# Altium project Mini RP2350 Board V0.PrjPcb
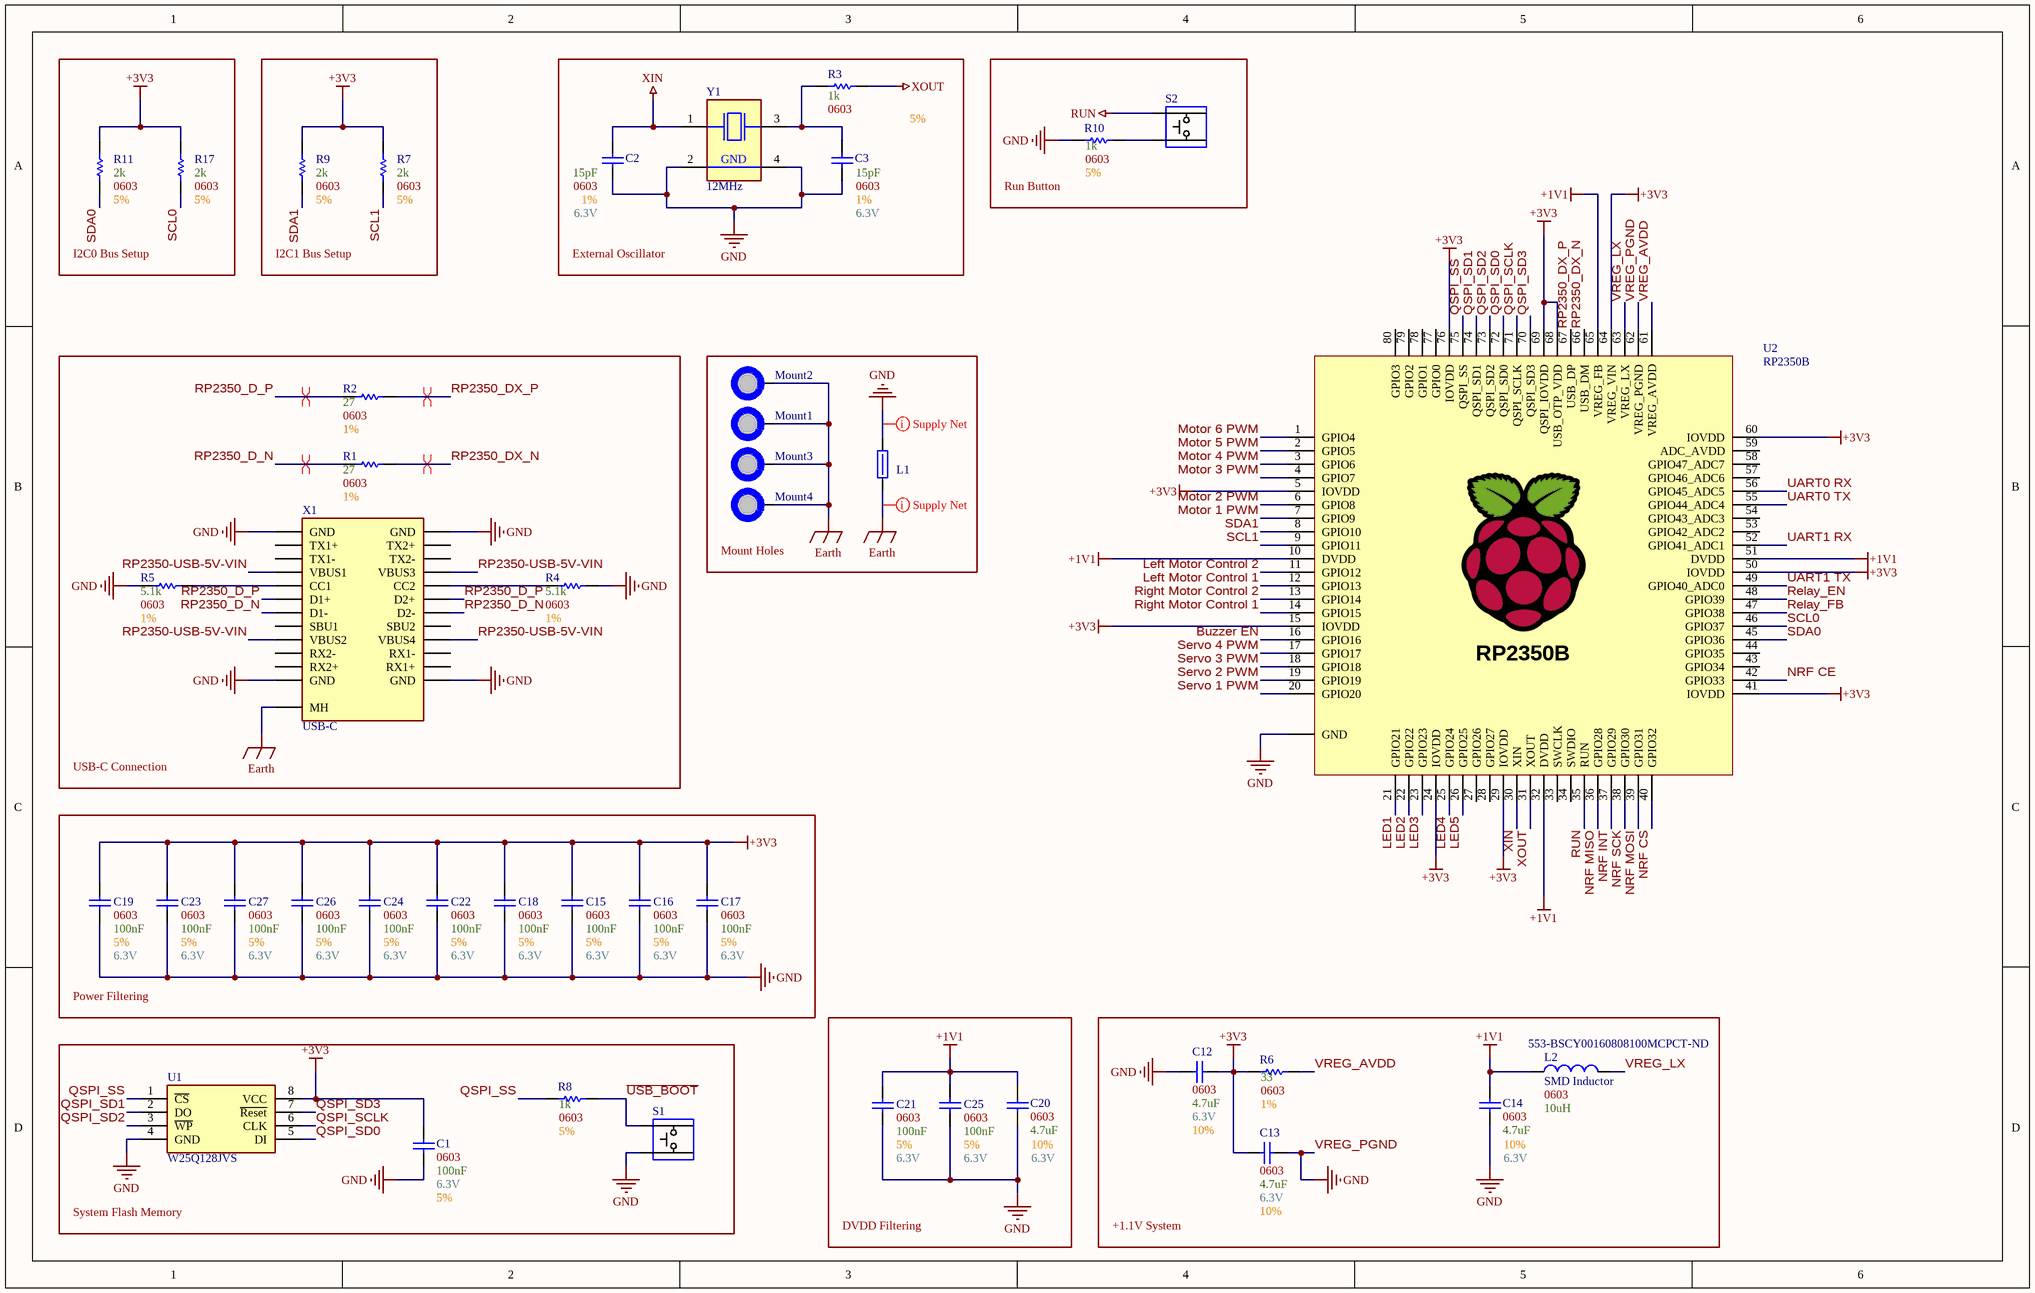
[diagram p0: RP2350.SchDoc]
3 sheets, 79 parts. Net scope: global (net labels, ports and power ports of the same name join across sheets).
Board file: Main.PcbDoc
Sheets:
  RP2350.SchDoc
  Connections.SchDoc
  Safety Devices.SchDoc

## Sheet RP2350.SchDoc
size B; SheetNumber: 1; SheetTotal: 3

### Parts
(Parts that share a designator on the sheet are numbered #1, #2 ... from top to bottom, then left to right.)
C1  Size Package: 0603  Capacitance: 100nF  Voltage: 6.3V  Tolerance: 5%  [[Cap] SMD 0603]  (hidden comment: [Cap] SMD Nonpolarized)
C2  Size Package: 0603  Capacitance: 15pF  Voltage: 6.3V  Tolerance: 1%  [[Cap] SMD 0603]  (hidden comment: [Cap] SMD Nonpolarized)
C3  Size Package: 0603  Capacitance: 15pF  Voltage: 6.3V  Tolerance: 1%  [[Cap] SMD 0603]  (hidden comment: [Cap] SMD Nonpolarized)
C12  Size Package: 0603  Capacitance: 4.7uF  Voltage: 6.3V  Tolerance: 10%  [[Cap] SMD 0603]  (hidden comment: [Cap] SMD Nonpolarized)
C13  Size Package: 0603  Capacitance: 4.7uF  Voltage: 6.3V  Tolerance: 10%  [[Cap] SMD 0603]  (hidden comment: [Cap] SMD Nonpolarized)
C14  Size Package: 0603  Capacitance: 4.7uF  Voltage: 6.3V  Tolerance: 10%  [[Cap] SMD 0603]  (hidden comment: [Cap] SMD Nonpolarized)
C15  Size Package: 0603  Capacitance: 100nF  Voltage: 6.3V  Tolerance: 5%  [[Cap] SMD 0603]  (hidden comment: [Cap] SMD Nonpolarized)
C16  Size Package: 0603  Capacitance: 100nF  Voltage: 6.3V  Tolerance: 5%  [[Cap] SMD 0603]  (hidden comment: [Cap] SMD Nonpolarized)
C17  Size Package: 0603  Capacitance: 100nF  Voltage: 6.3V  Tolerance: 5%  [[Cap] SMD 0603]  (hidden comment: [Cap] SMD Nonpolarized)
C18  Size Package: 0603  Capacitance: 100nF  Voltage: 6.3V  Tolerance: 5%  [[Cap] SMD 0603]  (hidden comment: [Cap] SMD Nonpolarized)
C19  Size Package: 0603  Capacitance: 100nF  Voltage: 6.3V  Tolerance: 5%  [[Cap] SMD 0603]  (hidden comment: [Cap] SMD Nonpolarized)
C20#1  Size Package: 0603  Capacitance: 4.7uF  Voltage: 6.3V  Tolerance: 10%  [[Cap] SMD 0603]  (hidden comment: [Cap] SMD Nonpolarized)
C21#1  Size Package: 0603  Capacitance: 100nF  Voltage: 6.3V  Tolerance: 5%  [[Cap] SMD 0603]  (hidden comment: [Cap] SMD Nonpolarized)
C22#1  Size Package: 0603  Capacitance: 100nF  Voltage: 6.3V  Tolerance: 5%  [[Cap] SMD 0603]  (hidden comment: [Cap] SMD Nonpolarized)
C23#1  Size Package: 0603  Capacitance: 100nF  Voltage: 6.3V  Tolerance: 5%  [[Cap] SMD 0603]  (hidden comment: [Cap] SMD Nonpolarized)
C24#1  Size Package: 0603  Capacitance: 100nF  Voltage: 6.3V  Tolerance: 5%  [[Cap] SMD 0603]  (hidden comment: [Cap] SMD Nonpolarized)
C25#1  Size Package: 0603  Capacitance: 100nF  Voltage: 6.3V  Tolerance: 5%  [[Cap] SMD 0603]  (hidden comment: [Cap] SMD Nonpolarized)
C26#1  Size Package: 0603  Capacitance: 100nF  Voltage: 6.3V  Tolerance: 5%  [[Cap] SMD 0603]  (hidden comment: [Cap] SMD Nonpolarized)
C27#1  Size Package: 0603  Capacitance: 100nF  Voltage: 6.3V  Tolerance: 5%  [[Cap] SMD 0603]  (hidden comment: [Cap] SMD Nonpolarized)
L1  652-MH2029-300Y  [[Ferrite] SMD Bead 0805 (1)]  (value not drawn)
L2#1  SMD Inductor  Size Package: 0603  Inductance: 10uH  Supplier Part Number 1: 553-BSCY00160808100MCPCT-ND  [[Inductor] SMD 0603]
Mount1#1  M3 Mount Hole  [[Mount] M3 Mount Hole]  (value not drawn)  (no BOM)
Mount2#1  M3 Mount Hole  [[Mount] M3 Mount Hole]  (value not drawn)  (no BOM)
Mount3#1  M3 Mount Hole  [[Mount] M3 Mount Hole]  (value not drawn)  (no BOM)
Mount4#1  M3 Mount Hole  [[Mount] M3 Mount Hole]  (value not drawn)  (no BOM)
R1  Tolerance: 1%  Resistance: 27  Size Package: 0603  [[Res] SMD 0603]  (hidden comment: [Res] SMD Resistor)
R2  Tolerance: 1%  Resistance: 27  Size Package: 0603  [[Res] SMD 0603]  (hidden comment: [Res] SMD Resistor)
R3  Resistance: 1k  Size Package: 0603  Tolerance: 5%  [[Res] SMD 0603]  (hidden comment: [Res] SMD Resistor)
R4  Tolerance: 1%  Resistance: 5.1k  Size Package: 0603  [[Res] SMD 0603]  (hidden comment: [Res] SMD Resistor)
R5  Tolerance: 1%  Resistance: 5.1k  Size Package: 0603  [[Res] SMD 0603]  (hidden comment: [Res] SMD Resistor)
R6  Resistance: 33  Size Package: 0603  Tolerance: 1%  [[Res] SMD 0603]  (hidden comment: [Res] SMD Resistor)
R7  Resistance: 2k  Size Package: 0603  Tolerance: 5%  [[Res] SMD 0603]  (hidden comment: [Res] SMD Resistor)
R8  Resistance: 1k  Size Package: 0603  Tolerance: 5%  [[Res] SMD 0603]  (hidden comment: [Res] SMD Resistor)
R9  Resistance: 2k  Size Package: 0603  Tolerance: 5%  [[Res] SMD 0603]  (hidden comment: [Res] SMD Resistor)
R10  Resistance: 1k  Size Package: 0603  Tolerance: 5%  [[Res] SMD 0603]  (hidden comment: [Res] SMD Resistor)
R11  Resistance: 2k  Size Package: 0603  Tolerance: 5%  [[Res] SMD 0603]  (hidden comment: [Res] SMD Resistor)
R17  Resistance: 2k  Size Package: 0603  Tolerance: 5%  [[Res] SMD 0603]  (hidden comment: [Res] SMD Resistor)
S1  Standard pushbutton  [[Switch] Pushbutton]  (value not drawn)
S2  Standard pushbutton  [[Switch] Pushbutton]  (value not drawn)
U1  W25Q128JVS  [[Mem] 16Mb Flash Memory]
U2  RP2350B  [[MCU] RP2350B]
X1  USB-C  [[Port] USB-C]
Y1  12MHz  [[XTAL] SMD 12MHz]

### Blocks framed on the sheet
I2C0 Bus Setup: R11 R17
I2C1 Bus Setup: R7 R9
External Oscillator: C2 C3 R3 Y1
Run Button: R10 S2
USB-C Connection: R1 R2 R4 R5 X1
Mount Holes: L1 Mount1#1 Mount2#1 Mount3#1 Mount4#1
Power Filtering: C15-C19 C22#1 C23#1 C24#1 C26#1 C27#1
DVDD Filtering: C20#1 C21#1 C25#1
+1.1V System: C12-C14 L2#1 R6
System Flash Memory: C1 R8 S1 U1

### Nets
+1V1: C14.2 C20#1.2 C21#1.2 C25#1.2 L2#1.1 U2.10(DVDD) U2.32(DVDD) U2.51(DVDD) U2.65(VREG_FB)
+3V3: C1.1 C12.1 C13.2 C15.2 C16.2 C17.2 C18.2 C19.2 C22#1.2 C23#1.2 C24#1.2 C26#1.2 C27#1.2 R6.2 R7.2 R9.2 R11.2 R17.2 U1.8(VCC) U2.5(IOVDD) U2.15(IOVDD) U2.24(IOVDD) U2.29(IOVDD) U2.41(IOVDD) U2.50(IOVDD) U2.60(IOVDD) U2.64(VREG_VIN) U2.68(USB_OTP_VDD) U2.69(QSPI_IOVDD) U2.76(IOVDD)
Earth: L1.1 Mount1#1.1 Mount2#1.1 Mount3#1.1 Mount4#1.1 X1.MH
GND: C1.2 C2.1 C3.1 C12.2 C13.1 C14.1 C15.1 C16.1 C17.1 C18.1 C19.1 C20#1.1 C21#1.1 C22#1.1 C23#1.1 C24#1.1 C25#1.1 C26#1.1 C27#1.1 L1.2 R4.2 R5.1 R10.2 S1.2 U1.4(GND) U2.62(VREG_PGND) U2.Pad(GND) X1.A1(GND) X1.A12(GND) X1.B1(GND) X1.B12(GND) Y1.2(GND) Y1.4(GND)  [also labelled VREG_PGND]
RUN: S2.1 U2.35(RUN)
XIN: C2.2 U2.30(XIN) Y1.1(XTAL1)
XOUT: R3.1 U2.31(XOUT)
Buzzer EN: U2.16(GPIO16)
LED1: U2.21(GPIO21)
LED2: U2.22(GPIO22)
LED3: U2.23(GPIO23)
LED4: U2.25(GPIO24)
LED5: U2.26(GPIO25)
Left Motor Control 1: U2.12(GPIO13)
Left Motor Control 2: U2.11(GPIO12)
Motor 1 PWM: U2.7(GPIO9)
Motor 2 PWM: U2.6(GPIO8)
Motor 3 PWM: U2.4(GPIO7)
Motor 4 PWM: U2.3(GPIO6)
Motor 5 PWM: U2.2(GPIO5)
Motor 6 PWM: U2.1(GPIO4)
NRF CE: U2.42(GPIO33)
NRF CS: U2.40(GPIO32)
NRF INT: U2.37(GPIO29)
NRF MISO: U2.36(GPIO28)
NRF MOSI: U2.39(GPIO31)
NRF SCK: U2.38(GPIO30)
QSPI_SCLK: U1.6(CLK) U2.71(QSPI_SCLK)
QSPI_SD0: U1.5(DI) U2.72(QSPI_SD0)
QSPI_SD1: U1.2(DO) U2.74(QSPI_SD1)
QSPI_SD2: U1.3(~{WP}) U2.73(QSPI_SD2)
QSPI_SD3: U1.7(~{Reset}) U2.70(QSPI_SD3)
QSPI_SS: R8.2 U1.1(~{CS}) U2.75(QSPI_SS)
Relay_EN: U2.48(GPIO39)
Relay_FB: U2.47(GPIO38)
Right Motor Control 1: U2.14(GPIO15)
Right Motor Control 2: U2.13(GPIO14)
RP2350-USB-5V-VIN: X1.A4(VBUS1) X1.A9(VBUS2) X1.B4(VBUS3) X1.B9(VBUS4)
RP2350_D_N: R1.1 X1.A7(D1-) X1.B7(D2-)
RP2350_D_P: R2.1 X1.A6(D1+) X1.B6(D2+)
RP2350_DX_N: R1.2 U2.66(USB_DM)
RP2350_DX_P: R2.2 U2.67(USB_DP)
SCL0: R17.1 U2.46(GPIO37)
SCL1: R7.1 U2.9(GPIO11)
SDA0: R11.1 U2.45(GPIO36)
SDA1: R9.1 U2.8(GPIO10)
Servo 1 PWM: U2.20(GPIO20)
Servo 2 PWM: U2.19(GPIO19)
Servo 3 PWM: U2.18(GPIO18)
Servo 4 PWM: U2.17(GPIO17)
~{USB_BOOT}: R8.1 S1.1
UART0 RX: U2.56(GPIO45_ADC5)
UART0 TX: U2.55(GPIO44_ADC4)
UART1 RX: U2.52(GPIO41_ADC1)
UART1 TX: U2.49(GPIO40_ADC0)
VREG_AVDD: R6.1 U2.61(VREG_AVDD)
VREG_LX: L2#1.2 U2.63(VREG_LX)
NetC3_2: C3.2 R3.2 Y1.3(XTAL2)
NetR4_1: R4.1 X1.B5(CC2)
NetR5_2: R5.2 X1.A5(CC1)
NetR10_1: R10.1 S2.2

Not connected (* = marked no-connect by the designer): U2 27(GPIO26) 28(GPIO27) 33(SWCLK) 34(SWDIO) 43(GPIO34) 44(GPIO35) 53(GPIO42_ADC2) 54(GPIO43_ADC3) 57(GPIO46_ADC6) 58(GPIO47_ADC7) 59(ADC_AVDD) 77(GPIO0) 78(GPIO1) 79(GPIO2) 80(GPIO3); X1 A2(TX1+) A3(TX1-) A8(SBU1) A10(RX2-) A11(RX2+) B2(TX2+) B3(TX2-) B8(SBU2) B10(RX1-) B11(RX1+)

### Layout directives
differential pair; differential pair class USB_Pairs: RP2350_D_N, RP2350_D_P, RP2350_DX_N, RP2350_DX_P
net class Supply_Nets: Earth, GND

### Library data of the parts
L1 = [Ferrite] SMD Ferrite Bead (1): Res @ Freq: 30 @ 100MHz; Size Package: 0805; Supplier 1: DigiKey; Supplier Part Number 1: MH2029-300YCT-ND
L2#1 = [Inductor] SMD Inductor: JLC Part #: *; Mouser Part #: *; Supplier 1: DigiKey
Mount1#1 Mount2#1 Mount3#1 Mount4#1 = [Mount] M3 Mount Hole: Place at least 4.5mm from board edge. Plated.
R1-R11 R17 = [Res] SMD Resistor: Generic; Supplier 1: DigiKey
  R1 R2: Supplier Part Number 1: 749-1631-1-ND
  R3 R8 R10: Supplier Part Number 1: RMCF0603FT1K00DKR-ND
  R4 R5: Supplier Part Number 1: 311-5.10KHRDKR-ND
  R6: Supplier Part Number 1: RR08Q33DCT-ND
  R7 R9 R11 R17: Supplier Part Number 1: P2.0KBDCT-ND
S1 S2 = [Switch] Pushbutton: Supplier 1: DigiKey; Supplier Part Number 1: 450-1650-ND
U1 = [Mem] 16Mb Flash Memory: W25Q128JVSIQ TR; Supplier 1: DigiKey; Supplier Part Number 1: 256-W25Q128JVSIQTRCT-ND
U2 = [MCU] RP2350B: QFN-80 Package; Supplier 1: DigiKey; Supplier Part Number 1: 2648-SC1510-A4CT-ND
X1 = [Port] USB Type-C: Supplier 1: DigiKey; Supplier Part Number 1: 670-3104-1-ND
Y1 = [XTAL] SMD 12MHz: 815-ABM8-272-T3; Supplier 1: DigiKey; Supplier Part Number 1: 535-ABM8-272-T3CT-ND
C1-C3 C12-C19 C20#1 C21#1 C22#1 C23#1 C24#1 C25#1 C26#1 C27#1 = [Cap] SMD Nonpolarized: Supplier 1: DigiKey
  C1 C15-C19 C21#1 C22#1 C23#1 C24#1 C25#1 C26#1 C27#1: Supplier Part Number 1: 311-1088-6-ND
  C2 C3: Supplier Part Number 1: 490-16416-1-ND
  C12-C14 C20#1: Supplier Part Number 1: 490-7203-1-ND

## Sheet Connections.SchDoc
size B; SheetNumber: 2; SheetTotal: 3
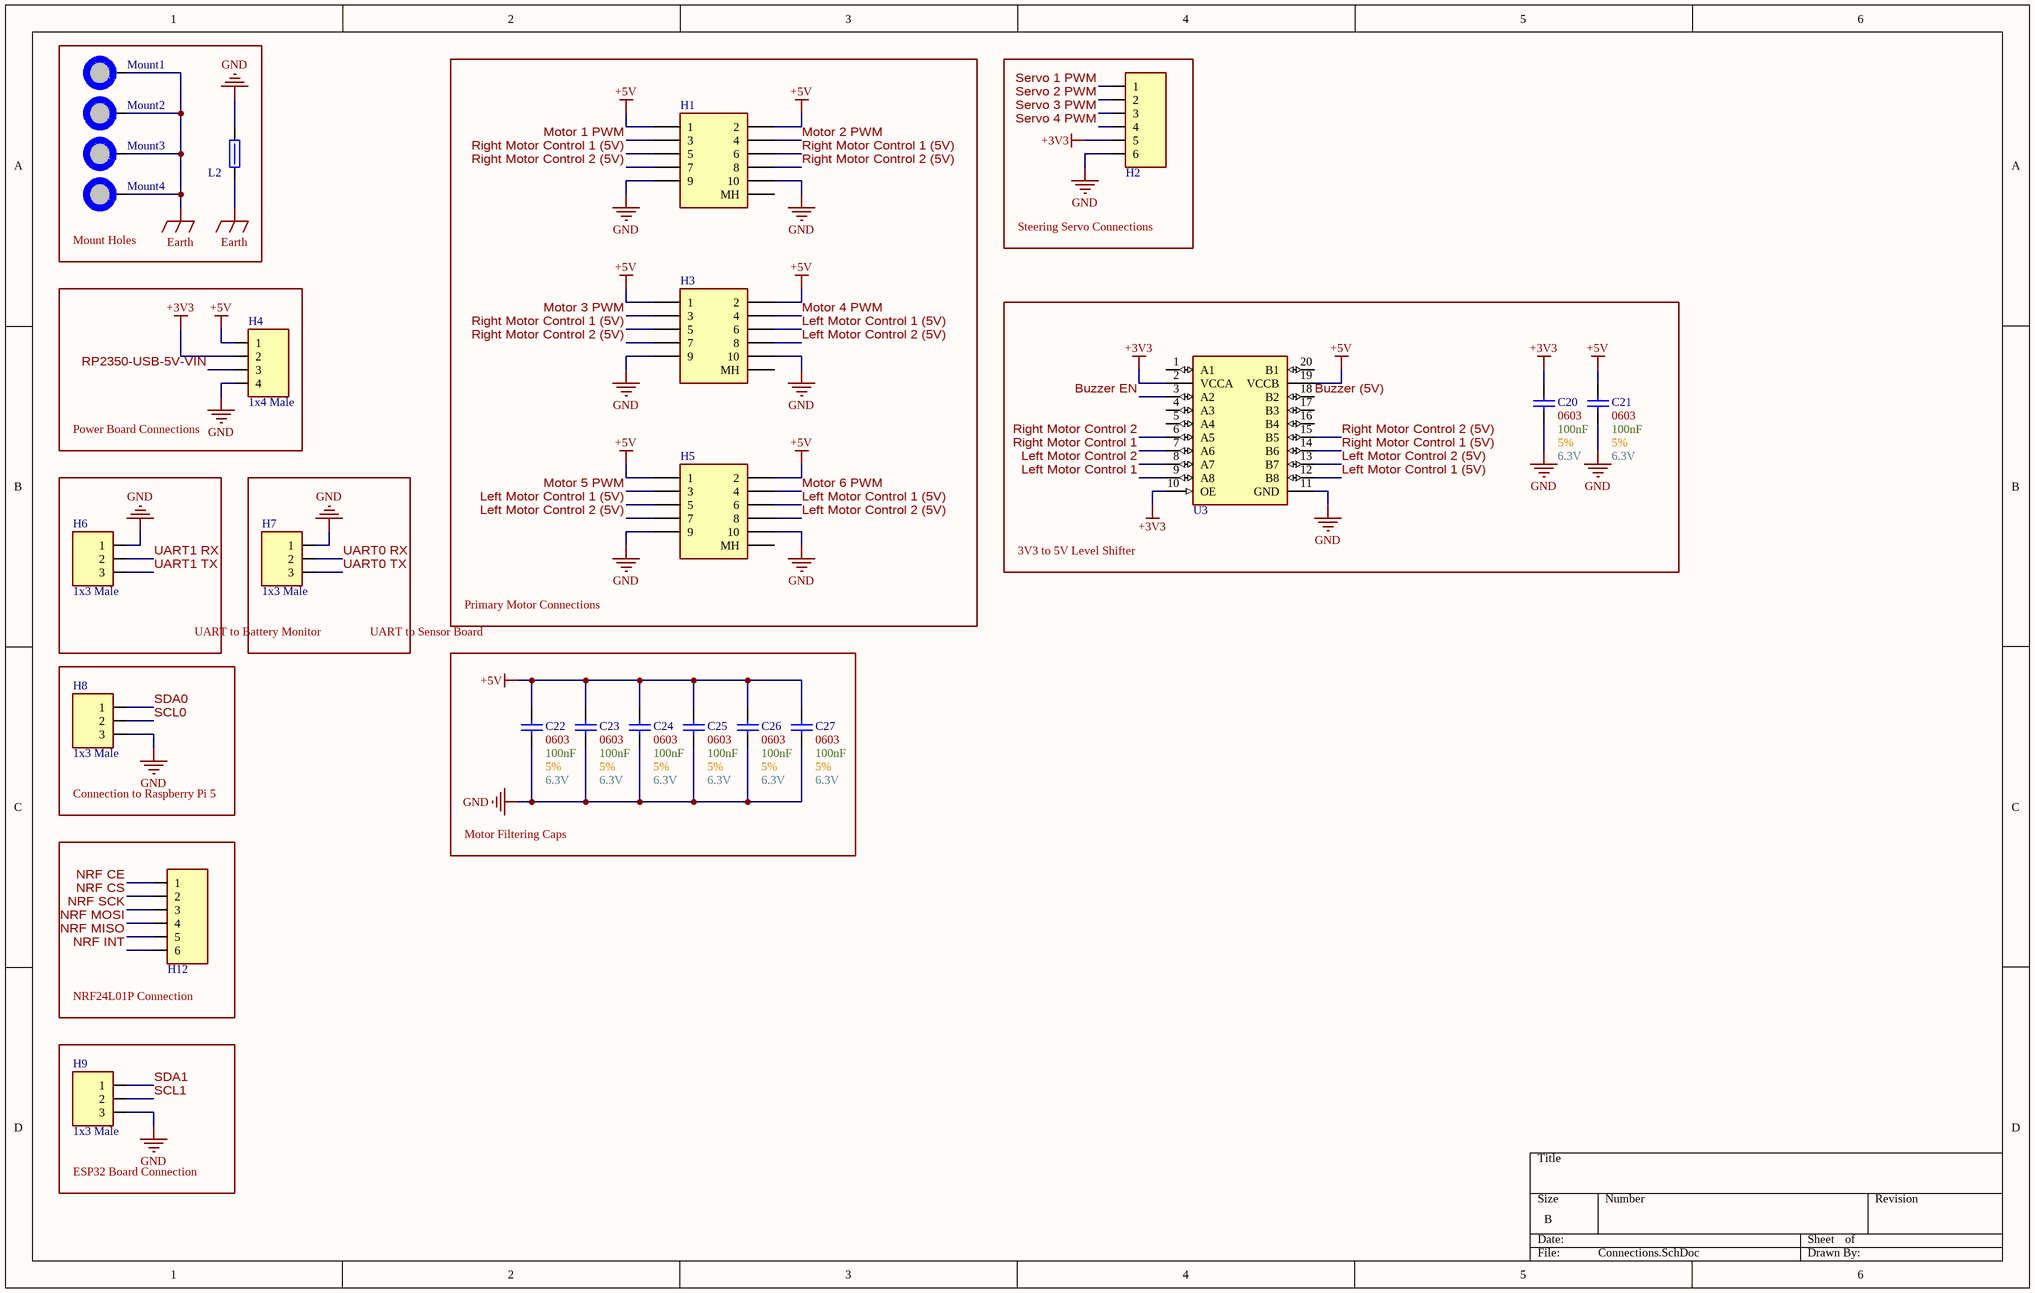
[diagram p1: Connections.SchDoc]

### Parts
(Parts that share a designator on the sheet are numbered #1, #2 ... from top to bottom, then left to right.)
C20#2  Size Package: 0603  Capacitance: 100nF  Voltage: 6.3V  Tolerance: 5%  [[Cap] SMD 0603]  (hidden comment: [Cap] SMD Nonpolarized)
C21#2  Size Package: 0603  Capacitance: 100nF  Voltage: 6.3V  Tolerance: 5%  [[Cap] SMD 0603]  (hidden comment: [Cap] SMD Nonpolarized)
C22#2  Size Package: 0603  Capacitance: 100nF  Voltage: 6.3V  Tolerance: 5%  [[Cap] SMD 0603]  (hidden comment: [Cap] SMD Nonpolarized)
C23#2  Size Package: 0603  Capacitance: 100nF  Voltage: 6.3V  Tolerance: 5%  [[Cap] SMD 0603]  (hidden comment: [Cap] SMD Nonpolarized)
C24#2  Size Package: 0603  Capacitance: 100nF  Voltage: 6.3V  Tolerance: 5%  [[Cap] SMD 0603]  (hidden comment: [Cap] SMD Nonpolarized)
C25#2  Size Package: 0603  Capacitance: 100nF  Voltage: 6.3V  Tolerance: 5%  [[Cap] SMD 0603]  (hidden comment: [Cap] SMD Nonpolarized)
C26#2  Size Package: 0603  Capacitance: 100nF  Voltage: 6.3V  Tolerance: 5%  [[Cap] SMD 0603]  (hidden comment: [Cap] SMD Nonpolarized)
C27#2  Size Package: 0603  Capacitance: 100nF  Voltage: 6.3V  Tolerance: 5%  [[Cap] SMD 0603]  (hidden comment: [Cap] SMD Nonpolarized)
H1  [Header] Shrouded 2x5 SMD  [[Header] Shrouded 2x5 SMD]  (value not drawn)
H2  [Header] Shrouded 1x6 Male  [[Header] Shrouded 1x6 Male]  (value not drawn)
H3  [Header] Shrouded 2x5 SMD  [[Header] Shrouded 2x5 SMD]  (value not drawn)
H4  1x4 Male  [[Header] Shrouded 1x4 Male]
H5#1  [Header] Shrouded 2x5 SMD  [[Header] Shrouded 2x5 SMD]  (value not drawn)
H6  1x3 Male  [[Header] Shrouded 1x3 Male]
H7  1x3 Male  [[Header] Shrouded 1x3 Male]
H8#1  1x3 Male  [[Header] Shrouded 1x3 Male]
H9  1x3 Male  [[Header] Shrouded 1x3 Male]
H12  [Header] Shrouded 1x6 Male  [[Header] Shrouded 1x6 Male]  (value not drawn)
L2#2  652-MH2029-300Y  [[Ferrite] SMD Bead 0805 (1)]  (value not drawn)
Mount1#2  M3 Mount Hole  [[Mount] M3 Mount Hole]  (value not drawn)  (no BOM)
Mount2#2  M3 Mount Hole  [[Mount] M3 Mount Hole]  (value not drawn)  (no BOM)
Mount3#2  M3 Mount Hole  [[Mount] M3 Mount Hole]  (value not drawn)  (no BOM)
Mount4#2  M3 Mount Hole  [[Mount] M3 Mount Hole]  (value not drawn)  (no BOM)
U3  [IC] Level Shifter (2)  [[IC] Level Shifter (2)]  (value not drawn)

### Blocks framed on the sheet
Mount Holes: L2#2 Mount1#2 Mount2#2 Mount3#2 Mount4#2
Primary Motor Connections: H1 H3 H5#1
Steering Servo Connections: H2
Power Board Connections: H4
3V3 to 5V Level Shifter: C20#2 C21#2 U3
UART to Battery Monitor: H6
UART to Sensor Board: H7
Connection to Raspberry Pi 5: H8#1
Motor Filtering Caps: C22#2 C23#2 C24#2 C25#2 C26#2 C27#2
NRF24L01P Connection: H12
ESP32 Board Connection: H9

### Nets
+3V3: C20#2.2 H2.5 H4.2 U3.2(VCCA) U3.10(OE)
+5V: C21#2.2 C22#2.2 C23#2.2 C24#2.2 C25#2.2 C26#2.2 C27#2.2 H1.1 H1.2 H3.1 H3.2 H4.1 H5#1.1 H5#1.2 U3.19(VCCB)
Earth: L2#2.1 Mount1#2.1 Mount2#2.1 Mount3#2.1 Mount4#2.1
GND: C20#2.1 C21#2.1 C22#2.1 C23#2.1 C24#2.1 C25#2.1 C26#2.1 C27#2.1 H1.9 H1.10 H2.6 H3.9 H3.10 H4.4 H5#1.9 H5#1.10 H6.1 H7.1 H8#1.3 H9.3 L2#2.2 U3.11(GND)
Buzzer (5V): U3.18(B2)
Buzzer EN: U3.3(A2)
Left Motor Control 1: U3.9(A8)
Left Motor Control 1 (5V): H3.6 H5#1.5 H5#1.6 U3.12(B8)
Left Motor Control 2: U3.8(A7)
Left Motor Control 2 (5V): H3.8 H5#1.7 H5#1.8 U3.13(B7)
Motor 1 PWM: H1.3
Motor 2 PWM: H1.4
Motor 3 PWM: H3.3
Motor 4 PWM: H3.4
Motor 5 PWM: H5#1.3
Motor 6 PWM: H5#1.4
NRF CE: H12.1
NRF CS: H12.2
NRF INT: H12.6
NRF MISO: H12.5
NRF MOSI: H12.4
NRF SCK: H12.3
Right Motor Control 1: U3.7(A6)
Right Motor Control 1 (5V): H1.5 H1.6 H3.5 U3.14(B6)
Right Motor Control 2: U3.6(A5)
Right Motor Control 2 (5V): H1.7 H1.8 H3.7 U3.15(B5)
RP2350-USB-5V-VIN: H4.3
SCL0: H8#1.2
SCL1: H9.2
SDA0: H8#1.1
SDA1: H9.1
Servo 1 PWM: H2.1
Servo 2 PWM: H2.2
Servo 3 PWM: H2.3
Servo 4 PWM: H2.4
UART0 RX: H7.2
UART0 TX: H7.3
UART1 RX: H6.2
UART1 TX: H6.3

Not connected (* = marked no-connect by the designer): H1 X(MH); H3 X(MH); H5#1 X(MH); U3 1(A1) 4(A3) 5(A4) 16(B4) 17(B3) 20(B1)

### Library data of the parts
H2 H12 = [Header] Shrouded 1x6 Male: 0705430005 / Mates with 0050579406; Supplier 1: DigiKey; Supplier 2: DigiKey; Supplier Part Number 1: WM4804-ND; Supplier Part Number 2: WM2904-ND
H4 = [Header] Shrouded 1x4 Male: 70543-0003 / Mates with 005057-9404; Supplier 1: Avnet; Supplier Part Number 1: 0705430003
H6 H7 H8#1 H9 = [Header] Shrouded 1x3 Male: 070543-0037 / Mates with 005057-9403; Supplier 1: DigiKey; Supplier Part Number 1: WM4825-ND
  H7 H8#1 H9: Supplier 2: DigiKey; Supplier Part Number 2: WM2901-ND
L2#2 = [Ferrite] SMD Ferrite Bead (1): Res @ Freq: 30 @ 100MHz; Size Package: 0805
Mount1#2 Mount2#2 Mount3#2 Mount4#2 = [Mount] M3 Mount Hole: as Mount1#1 on sheet RP2350
U3 = [IC] Level Shifter (2): TXS0108EQPWRQ1; Supplier 1: DigiKey; Supplier Part Number 1: 296-42401-1-ND
C20#2 C21#2 C22#2 C23#2 C24#2 C25#2 C26#2 C27#2 = [Cap] SMD Nonpolarized: Supplier 1: DigiKey; Supplier Part Number 1: 311-1088-6-ND
H1 H3 H5#1 = [Header] Shrouded 2x5 SMD: Supplier 1: DigiKey; Supplier Part Number 1: WM4227-ND

## Sheet Safety Devices.SchDoc
size A; SheetNumber: 3; SheetTotal: 3
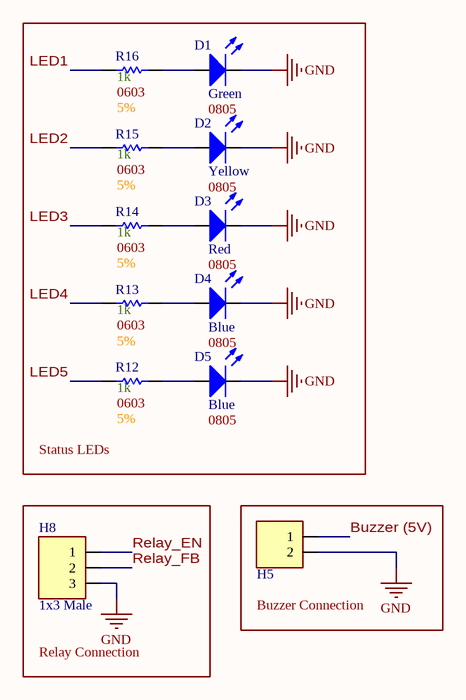
[diagram p2: Safety Devices.SchDoc]

### Parts
(Parts that share a designator on the sheet are numbered #1, #2 ... from top to bottom, then left to right.)
D1  Color: Green  Size Package: 0805  [[LED] SMD 0805]  (hidden comment: SMD LED)
D2  Color: Yellow  Size Package: 0805  [[LED] SMD 0805]  (hidden comment: SMD LED)
D3  Color: Red  Size Package: 0805  [[LED] SMD 0805]  (hidden comment: SMD LED)
D4  Color: Blue  Size Package: 0805  [[LED] SMD 0805]  (hidden comment: SMD LED)
D5  Color: Blue  Size Package: 0805  [[LED] SMD 0805]  (hidden comment: SMD LED)
H5#2  1x2 Male  [[Header] Shrouded 1x2 Male]  (value not drawn)
H8#2  1x3 Male  [[Header] Shrouded 1x3 Male]
R12  Resistance: 1k  Size Package: 0603  Tolerance: 5%  [[Res] SMD 0603]  (hidden comment: [Res] SMD Resistor)
R13  Resistance: 1k  Size Package: 0603  Tolerance: 5%  [[Res] SMD 0603]  (hidden comment: [Res] SMD Resistor)
R14  Resistance: 1k  Size Package: 0603  Tolerance: 5%  [[Res] SMD 0603]  (hidden comment: [Res] SMD Resistor)
R15  Resistance: 1k  Size Package: 0603  Tolerance: 5%  [[Res] SMD 0603]  (hidden comment: [Res] SMD Resistor)
R16  Resistance: 1k  Size Package: 0603  Tolerance: 5%  [[Res] SMD 0603]  (hidden comment: [Res] SMD Resistor)

### Blocks framed on the sheet
Status LEDs: D1-D5 R12-R16
Relay Connection: H8#2
Buzzer Connection: H5#2

### Nets
GND: D1.2(Cathode) D2.2(Cathode) D3.2(Cathode) D4.2(Cathode) D5.2(Cathode) H5#2.2 H8#2.3
Buzzer (5V): H5#2.1
LED1: R16.2
LED2: R15.2
LED3: R14.2
LED4: R13.2
LED5: R12.2
Relay_EN: H8#2.1
Relay_FB: H8#2.2
NetD1_1: D1.1(Anode) R16.1
NetD2_1: D2.1(Anode) R15.1
NetD3_1: D3.1(Anode) R14.1
NetD4_1: D4.1(Anode) R13.1
NetD5_1: D5.1(Anode) R12.1

### Library data of the parts
D1-D5 = [LED] SMD: Generic; Part #: *; Supplier 1: DigiKey
  D1: Supplier Part Number 1: 475-LGR971-KN-1CT-ND
  D2: Supplier Part Number 1: 475-LYR976-PS-36-0-20-R18CT-ND
  D3: Supplier Part Number 1: 475-LSR976-NR-1CT-ND
  D4 D5: Supplier Part Number 1: 732-4982-1-ND
H5#2 = [Header] Shrouded 1x2 Male: 0705430036 / Mates with 0050579402; Supplier 1: DigiKey; Supplier 2: DigiKey; Supplier Part Number 2: WM2900-ND; Supplier Part Number 1: WM4824-ND
H8#2 = [Header] Shrouded 1x3 Male: 070543-0037 / Mates with 005057-9403; Supplier 1: DigiKey; Supplier 2: DigiKey; Supplier Part Number 1: WM4825-ND; Supplier Part Number 2: WM2901-ND
R12-R16 = [Res] SMD Resistor: Generic; Supplier 1: DigiKey; Supplier Part Number 1: RMCF0603FT1K00DKR-ND

## Nets that join several sheets
+3V3: RP2350 (30 pins), Connections (5 pins)
Earth: RP2350 (6 pins), Connections (5 pins)
GND: RP2350 (33 pins), Connections (22 pins), Safety Devices (7 pins)
Buzzer (5V): Connections (U3.18), Safety Devices (H5#2.1)
Buzzer EN: RP2350 (U2.16), Connections (U3.3)
LED1: RP2350 (U2.21), Safety Devices (R16.2)
LED2: RP2350 (U2.22), Safety Devices (R15.2)
LED3: RP2350 (U2.23), Safety Devices (R14.2)
LED4: RP2350 (U2.25), Safety Devices (R13.2)
LED5: RP2350 (U2.26), Safety Devices (R12.2)
Left Motor Control 1: RP2350 (U2.12), Connections (U3.9)
Left Motor Control 2: RP2350 (U2.11), Connections (U3.8)
Motor 1 PWM: RP2350 (U2.7), Connections (H1.3)
Motor 2 PWM: RP2350 (U2.6), Connections (H1.4)
Motor 3 PWM: RP2350 (U2.4), Connections (H3.3)
Motor 4 PWM: RP2350 (U2.3), Connections (H3.4)
Motor 5 PWM: RP2350 (U2.2), Connections (H5#1.3)
Motor 6 PWM: RP2350 (U2.1), Connections (H5#1.4)
NRF CE: RP2350 (U2.42), Connections (H12.1)
NRF CS: RP2350 (U2.40), Connections (H12.2)
NRF INT: RP2350 (U2.37), Connections (H12.6)
NRF MISO: RP2350 (U2.36), Connections (H12.5)
NRF MOSI: RP2350 (U2.39), Connections (H12.4)
NRF SCK: RP2350 (U2.38), Connections (H12.3)
Relay_EN: RP2350 (U2.48), Safety Devices (H8#2.1)
Relay_FB: RP2350 (U2.47), Safety Devices (H8#2.2)
Right Motor Control 1: RP2350 (U2.14), Connections (U3.7)
Right Motor Control 2: RP2350 (U2.13), Connections (U3.6)
RP2350-USB-5V-VIN: RP2350 (X1.A4 X1.A9 X1.B4 X1.B9), Connections (H4.3)
SCL0: RP2350 (R17.1 U2.46), Connections (H8#1.2)
SCL1: RP2350 (R7.1 U2.9), Connections (H9.2)
SDA0: RP2350 (R11.1 U2.45), Connections (H8#1.1)
SDA1: RP2350 (R9.1 U2.8), Connections (H9.1)
Servo 1 PWM: RP2350 (U2.20), Connections (H2.1)
Servo 2 PWM: RP2350 (U2.19), Connections (H2.2)
Servo 3 PWM: RP2350 (U2.18), Connections (H2.3)
Servo 4 PWM: RP2350 (U2.17), Connections (H2.4)
UART0 RX: RP2350 (U2.56), Connections (H7.2)
UART0 TX: RP2350 (U2.55), Connections (H7.3)
UART1 RX: RP2350 (U2.52), Connections (H6.2)
UART1 TX: RP2350 (U2.49), Connections (H6.3)